# EAGLE design PDB_MH (EAGLE 7.6.0)
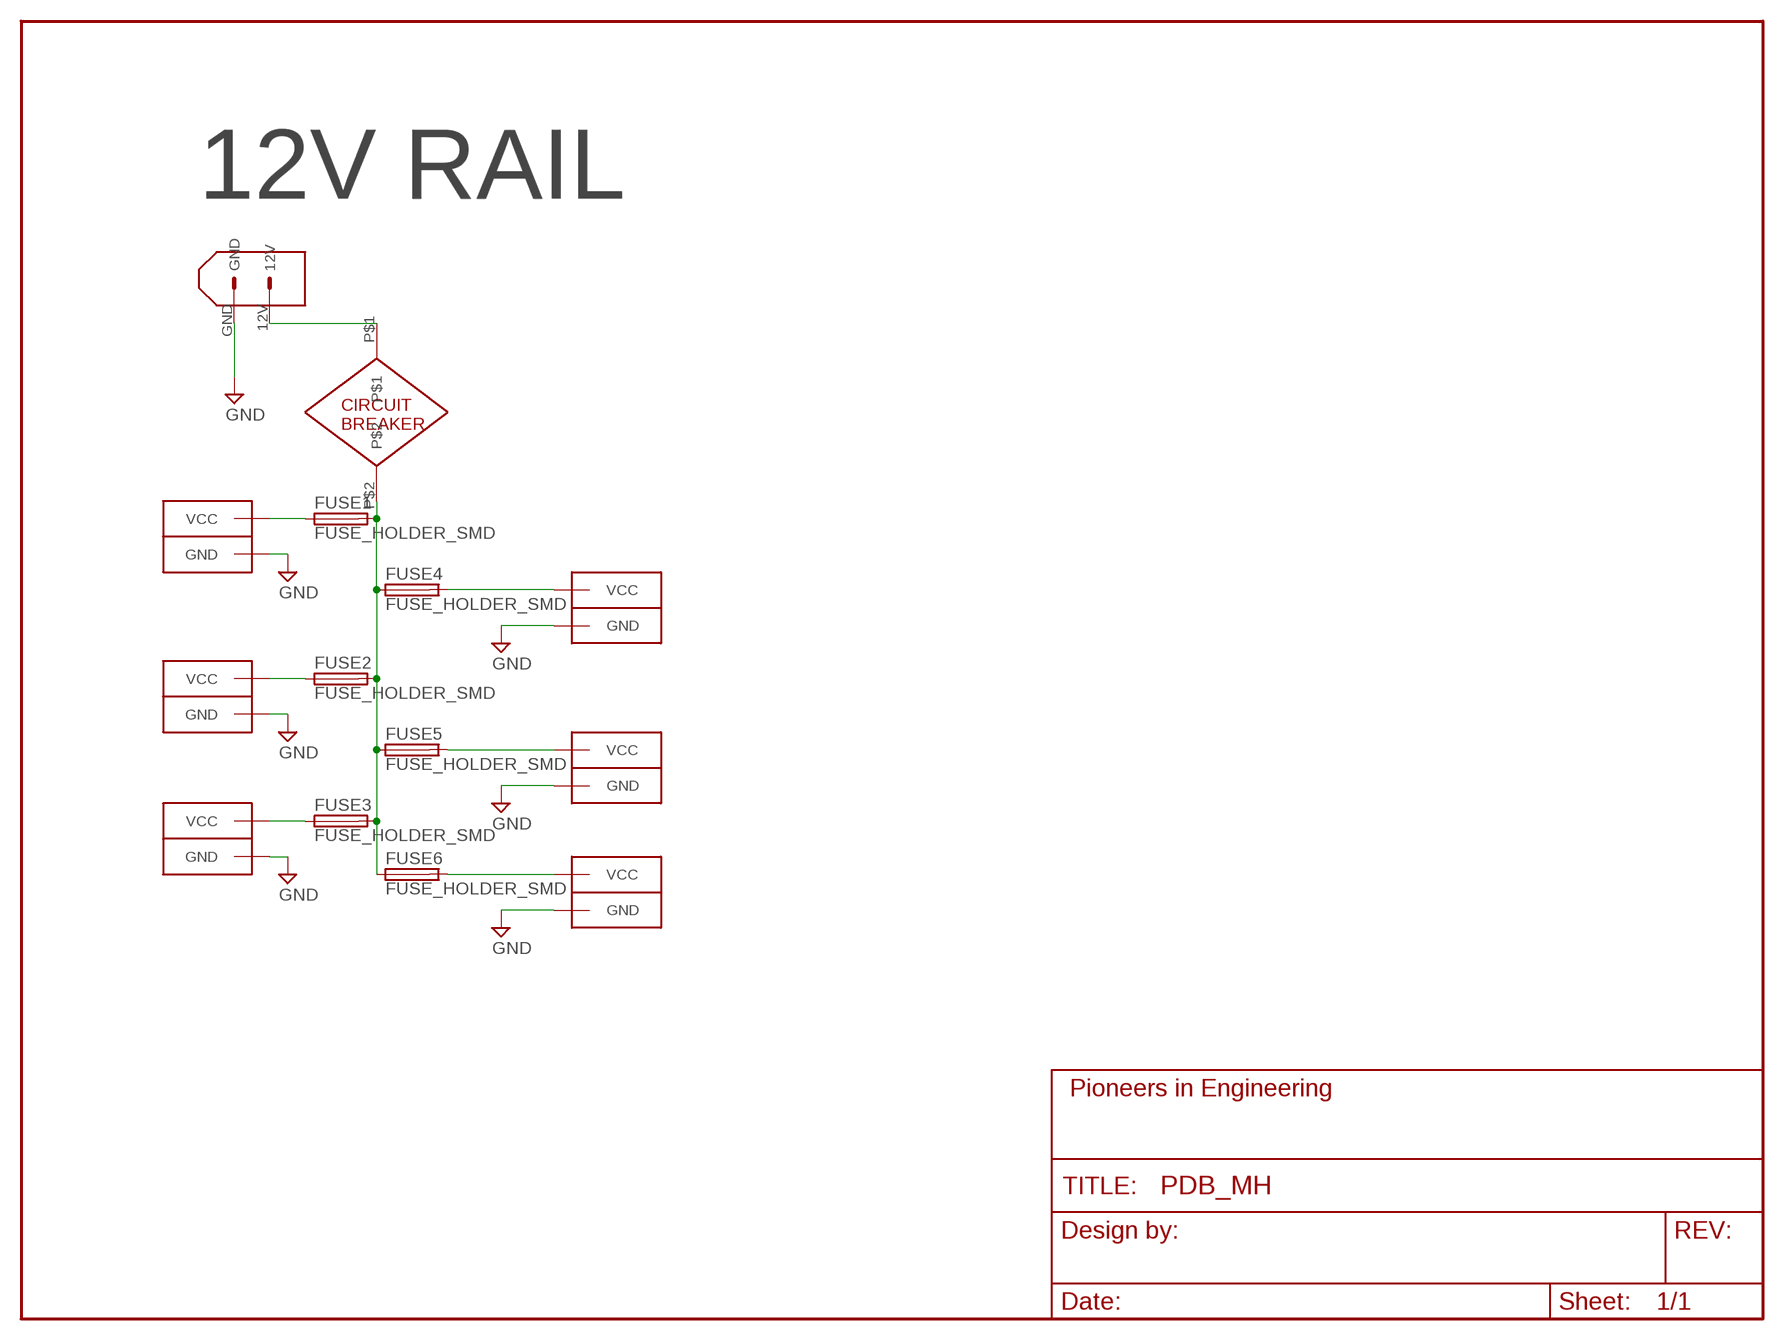
[diagram p0: schematic, sheet 1]

## Parts
CIRCUIT_BREAKER  CIRC_BREAKER  [CIRC_BREAKER]
CONN1  ANDERSONVERTICAL  [ANDERSON_VERTICAL]
CONN2  ANDERSONVERTICAL  [ANDERSON_VERTICAL]
CONN3  ANDERSONVERTICAL  [ANDERSON_VERTICAL]
CONN4  ANDERSONVERTICAL  [ANDERSON_VERTICAL]
CONN5  ANDERSONVERTICAL  [ANDERSON_VERTICAL]
CONN6  ANDERSONVERTICAL  [ANDERSON_VERTICAL]
FUSE1  FUSE_HOLDER_SMD  [FUSE_HOLDER_SMD]
FUSE2  FUSE_HOLDER_SMD  [FUSE_HOLDER_SMD]
FUSE3  FUSE_HOLDER_SMD  [FUSE_HOLDER_SMD]
FUSE4  FUSE_HOLDER_SMD  [FUSE_HOLDER_SMD]
FUSE5  FUSE_HOLDER_SMD  [FUSE_HOLDER_SMD]
FUSE6  FUSE_HOLDER_SMD  [FUSE_HOLDER_SMD]
U$1  XT60CONNECTOR  [XT60CONNECTOR]

## Nets
12V: CIRCUIT_BREAKER.P$2 FUSE1.P$2_DOWN FUSE1.P$2_UP FUSE2.P$2_DOWN FUSE2.P$2_UP FUSE3.P$2_DOWN FUSE3.P$2_UP FUSE4.P$1_DOWN FUSE4.P$1_UP FUSE5.P$1_DOWN FUSE5.P$1_UP FUSE6.P$1_DOWN FUSE6.P$1_UP
BAT: CIRCUIT_BREAKER.P$1 U$1.12V
GND: CONN1.PIN1(GND) CONN2.PIN1(GND) CONN3.PIN1(GND) CONN4.PIN1(GND) CONN5.PIN1(GND) CONN6.PIN1(GND) U$1.GND
VOUT1: CONN1.PIN2(VCC) FUSE1.P$1_DOWN FUSE1.P$1_UP
VOUT2: CONN2.PIN2(VCC) FUSE2.P$1_DOWN FUSE2.P$1_UP
VOUT3: CONN3.PIN2(VCC) FUSE3.P$1_DOWN FUSE3.P$1_UP
VOUT4: CONN4.PIN2(VCC) FUSE4.P$2_DOWN FUSE4.P$2_UP
VOUT5: CONN5.PIN2(VCC) FUSE5.P$2_DOWN FUSE5.P$2_UP
VOUT6: CONN6.PIN2(VCC) FUSE6.P$2_DOWN FUSE6.P$2_UP

## Notes on the sheet
- 12V RAIL

## Library data of the parts
CIRCUIT_BREAKER = pie:CIRC_BREAKER: PiE Circuit Breaker: product page <http://www.waytekwire.com/item/46977/Bussmann-25550-B-2-Mid-Range-Circuit-Breaker-/>; MANUF: WAYTEK; MANUF-PN: 46977
CONN1-CONN6 = pie:ANDERSON: 2-pin 25A Anderson Connector http://www.alliedelec.com/images/products/datasheets/bm/ANDERSON_POWER_PRODUCTS/70162018.pdf; PIE-INT-REF-NUM: Anderson
FUSE1-FUSE6 = pie:FUSE_HOLDER_SMD: ATC/ATO Fuse Holder. Original variant datasheet <http://keyelco.com/userAssets/file/M65p43.pdf> and Digikey <http://www.digikey.com/product-detail/en/keystone-electronics/3587/36-3587-ND/2137315>; DIGIKEY-PN: 36-3587-ND; MANUF: KEYSTONE; MANUF-PN: 3587
U$1 = pie:XT60CONNECTOR: 12V XT60 power connector; PARTNUMBER: PRT-10474

## Board
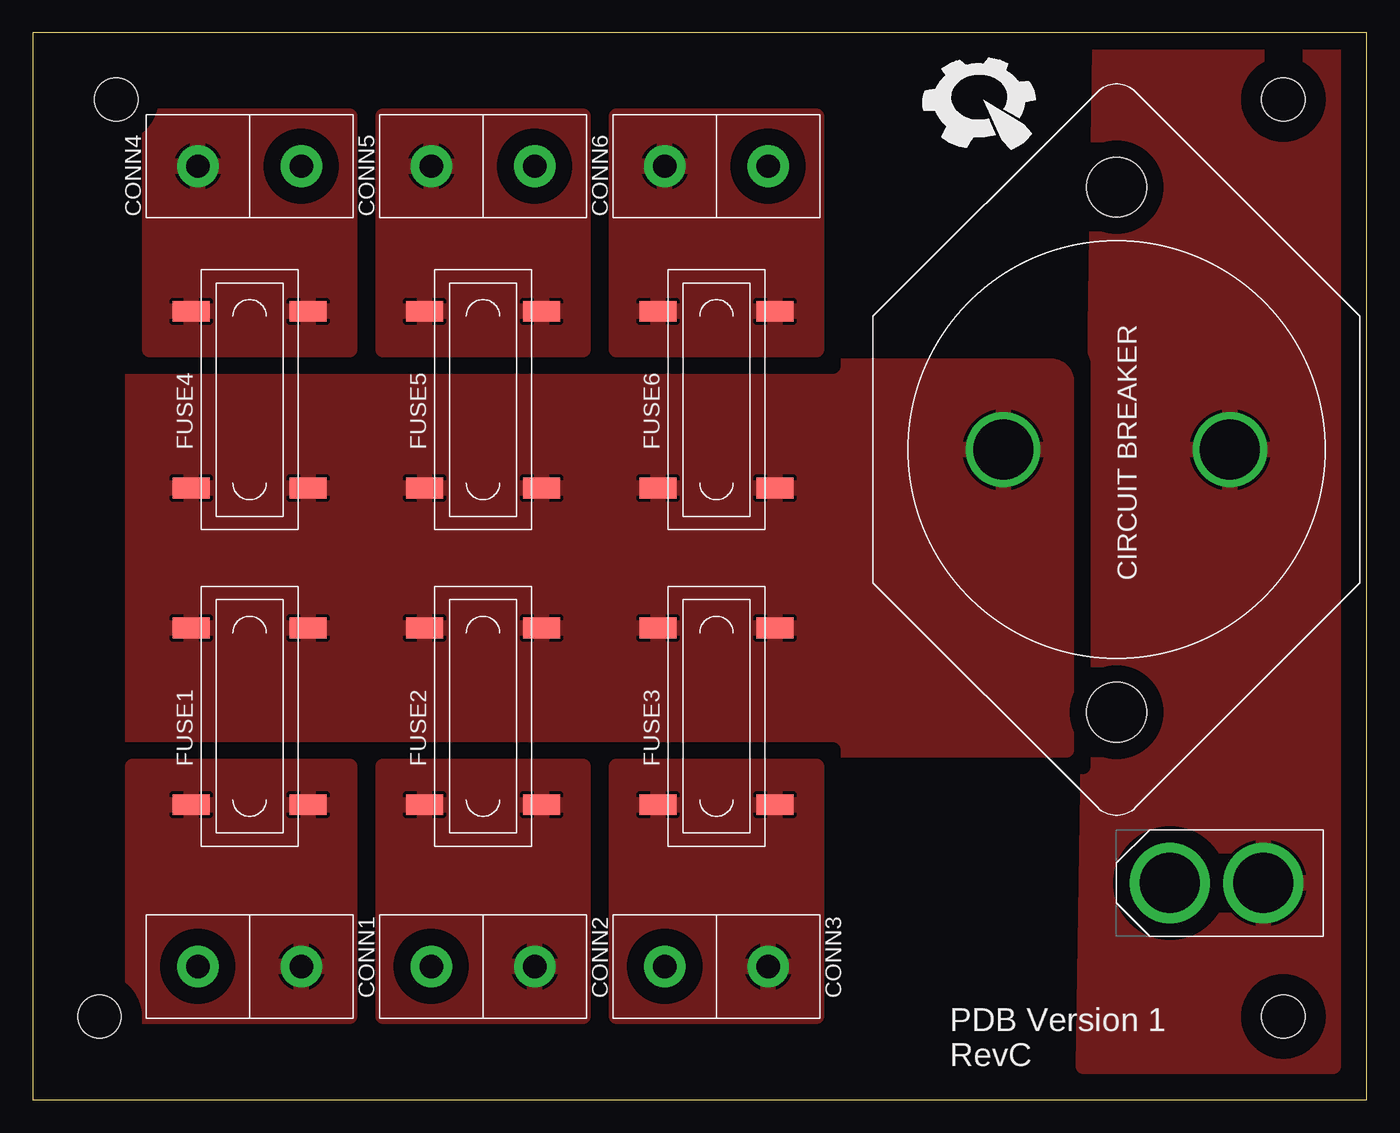
[diagram p1: board, top side]
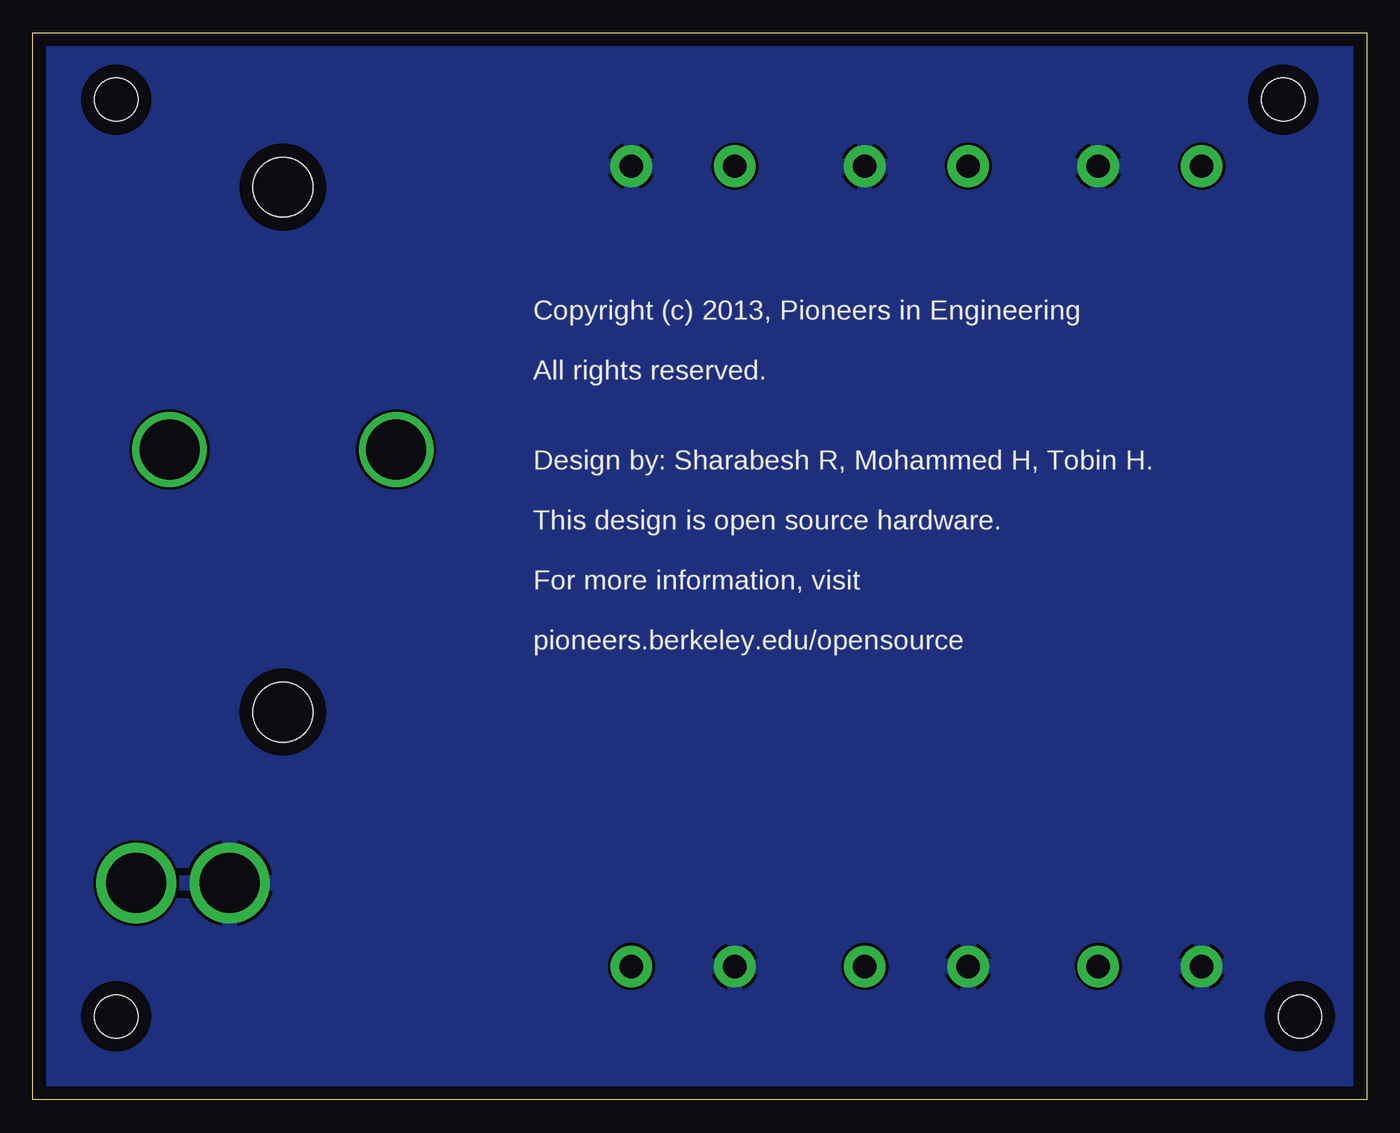
[diagram p2: board, bottom side, seen from below]

Size 101.6 x 81.28 mm. Coordinates in mm from the lower left corner, seen from the top.
Outline: 0,0 101.6,0 101.6,81.28 0,81.28 0,0
Copper layers (1*16): Top 0.035mm / dielectric 1.5mm / Bottom 0.035mm
Design rules "default": minimum track width 10mil, minimum drill 24mil, track to track 8mil, track to pad 8mil, pad to pad 8mil, via to via 8mil, smd to smd 8mil, copper to edge 40mil, drill to drill 8mil, minimum pad ring 10mil, minimum via ring 8mil, stop-mask expansion 4mil, vias tented up to drill 0mil, thermal gap 10mil

### Footprints (pad centres in the part's own frame; a part is rotated, then mirrored left to right if it is on the bottom)
CIRC_BREAKER = drill 4.572 pad 5.69: P$1 0,8.636; P$2 0,-8.636 | hole 4.572: -19.99,0; 19.99,0
ANDERSON_VERTICAL = drill 1.778 pad 3.175: PIN1 0,-3.937; PIN2 0,3.937
FUSE_HOLDER_SMD = smd 1.575 x 2.819: P$1_DOWN -6.731,-4.445; P$1_UP -6.731,4.445; P$2_DOWN 6.731,-4.445; P$2_UP 6.731,4.445
XT60CONNECTOR = drill 4.572 pad 6.096: 12V -3.556,0; GND 3.556,0
STAND-OFF = hole 3.302: 0,0

### Placement (x,y rotation side)
CIRCUIT_BREAKER  82.55,49.53 270 top
CONN1  16.51,10.16 270 top
CONN2  34.29,10.16 270 top
CONN3  52.07,10.16 270 top
CONN4  16.51,71.12 90 top
CONN5  34.29,71.12 90 top
CONN6  52.07,71.12 90 top
FUSE1  16.51,29.21 90 top
FUSE2  34.29,29.21 90 top
FUSE3  52.07,29.21 90 top
FUSE4  16.51,53.34 90 top
FUSE5  34.29,53.34 90 top
FUSE6  52.07,53.34 90 top
U$1  90.17,16.51 180 top
U$2  [STAND-OFF]  5.08,6.35 0 top
U$3  [STAND-OFF]  6.35,76.2 0 bottom
U$4  [STAND-OFF]  95.25,76.2 90 top
U$5  [STAND-OFF]  95.25,6.35 0 top
U$6  [PIE-LOGO-SMALL]  72.39,76.2 0 top

### Tracks (layer width: path | path; a pad name or v marks a point on that pad's centre or on a via)
12V
  pour Top (isolate 1.27, rank 2): 7.62,55.88 77.55,55.88 arc-90 78.74,54.69 78.74,26.67 7.62,26.59
BAT
  pour Top (isolate 1.27, rank 3): 81.28,80.01 99.06,80.01 99.06,2.54 80.01,2.54
GND
  pour Bottom (rank 6): 0,81.28 101.6,81.28 101.6,0 0,0
VOUT1
  pour Top (isolate 1.27): 7.62,25.4 24.13,25.4 24.13,6.35 7.62,6.35
VOUT2
  pour Top (isolate 1.27): 26.67,25.4 41.91,25.4 41.91,6.35 26.67,6.35
VOUT3
  pour Top (isolate 1.27): 44.45,25.4 59.69,25.4 59.69,6.35 44.45,6.35
VOUT4
  pour Top (isolate 1.27): 8.89,57.15 24.13,57.15 24.13,74.93 8.89,74.93
VOUT5
  pour Top (isolate 1.27): 26.67,57.15 41.91,57.15 41.91,74.93 26.67,74.93
VOUT6
  pour Top (isolate 1.27): 44.45,57.15 59.69,57.15 59.69,74.93 44.45,74.93

### Text on the board
tPlace: PDB Version 1 / RevC
bPlace: Copyright (c) 2013, Pioneers in Engineering / / All rights reserved. / / / Design by: Sharabesh R, Mohammed H, Tobin H. / / This design is open source hardware. / / For more information, visit / / pioneers.berkeley.edu/opensource